# EAGLE design node (EAGLE 6.5.0)
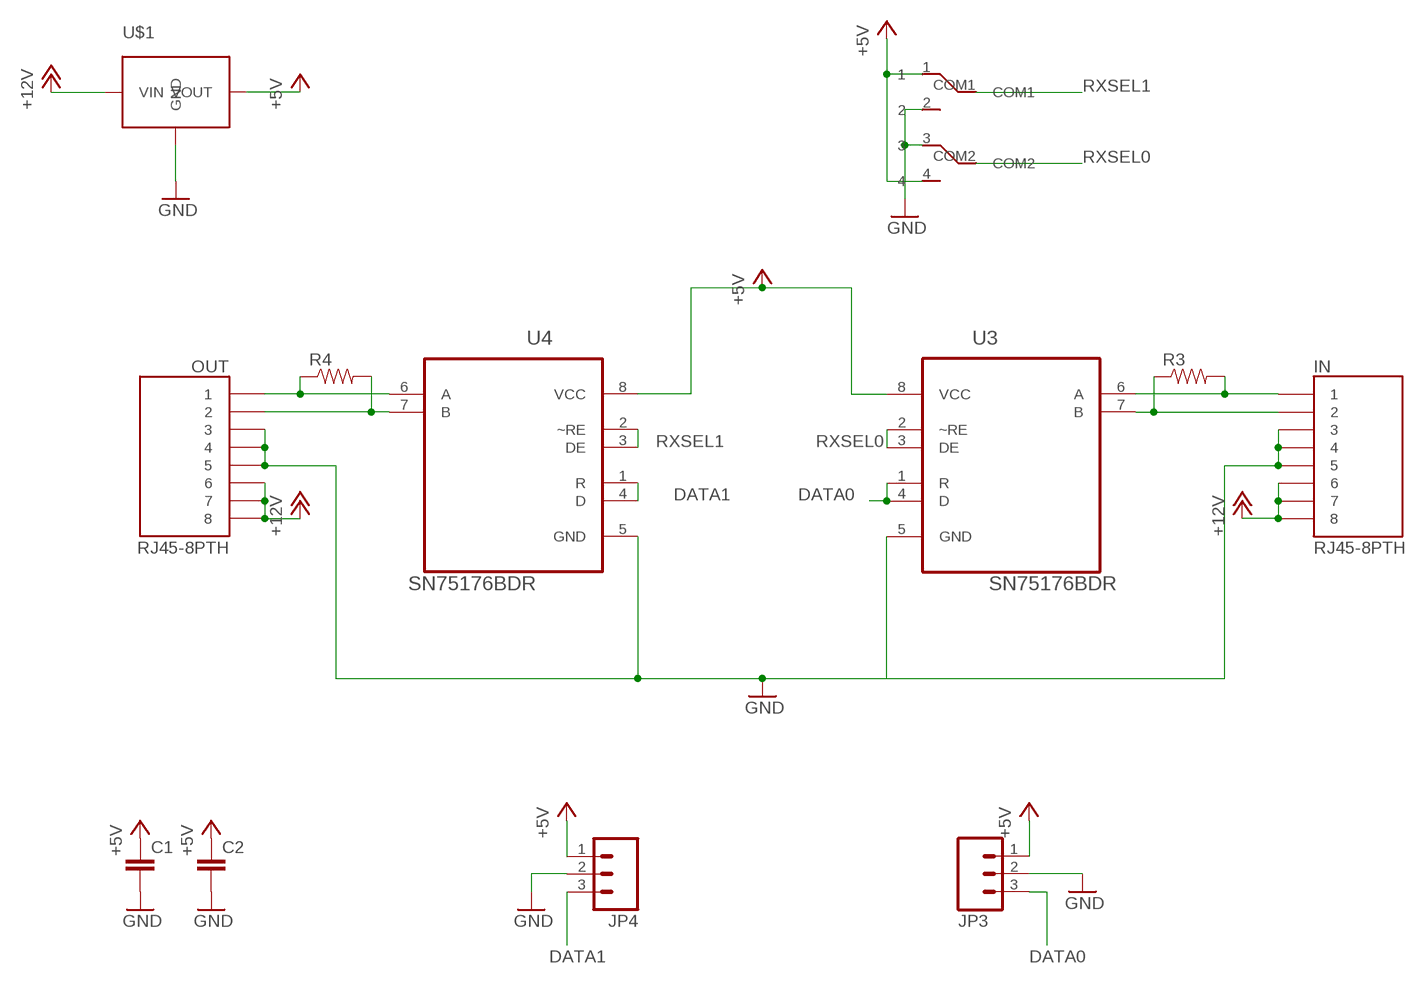
[diagram p0: schematic, sheet 1]

## Parts
C1  CAPPTH1  [CAP-PTH-5MM]
C2  CAPPTH1  [CAP-PTH-5MM]
IN  RJ45-8PTH  [RJ45-8]
JP3  M03JST-PTH  [JST-3-PTH]
JP4  M03JST-PTH  [JST-3-PTH]
OUT  RJ45-8PTH  [RJ45-8]
R3  RESISTORPTH-1/2W  [AXIAL-0.5]
R4  RESISTORPTH-1/2W  [AXIAL-0.5]
U3  SN75176BDR  [SOIC127P600X175-8N]
U4  SN75176BDR  [SOIC127P600X175-8N]
U$1  TSR1-2450  [TSR-1]
U$2  SWITCH-NKK-DPDT  [SWITCH-NKK-DPDT]

## Nets
+5V: C1.1 C2.1 JP3.1 JP4.1 U3.8(VCC) U4.8(VCC) U$1.3(VOUT) U$2.1 U$2.4
+12V: IN.6 IN.7 IN.8 OUT.6 OUT.7 OUT.8 U$1.1(VIN)
DATA0: JP3.3 U3.1(R) U3.4(D)
DATA1: JP4.3 U4.1(R) U4.4(D)
GND: C1.2 C2.2 IN.3 IN.4 IN.5 JP3.2 JP4.2 OUT.3 OUT.4 OUT.5 U3.5(GND) U4.5(GND) U$1.2(GND) U$2.2 U$2.3
N$1: IN.1 R3.P$2 U3.6(A)
N$2: IN.2 R3.P$1 U3.7(B)
N$3: OUT.1 R4.P$1 U4.6(A)
N$4: OUT.2 R4.P$2 U4.7(B)
RXSEL0: U3.2(~RE) U3.3(DE) U$2.COM2
RXSEL1: U4.2(~RE) U4.3(DE) U$2.COM1

## Library data of the parts
C1 C2 = SparkFun-Capacitors:CAP: Capacitor Standard 0603 ceramic capacitor, and 0.1" leaded capacitor.
IN OUT = SparkFun-Connectors:RJ45-8: RJ45 Jack Simple RJ45, 8-pin connection - connector for common Cat5, Cat5e, and Cat6 Ethernet cables. Footprint not yet proven in production. Connector sku is PRT-00643; Breakout PCB sku is BOB-00716.
JP3 JP4 = SparkFun-Connectors:M03: Header 3 Standard 3-pin 0.1" header. Use with straight break away headers (SKU : PRT-00116), right angle break away headers (PRT-00553), swiss pins (PRT-00743), machine pins (PRT-00117), and female headers (PRT-00115). Molex polarized connector foot print use with SKU : PRT-08232 with associated crimp pins and housings.
R3 R4 = SparkFun-Passives:RESISTOR: Resistor Basic schematic elements and footprints for 0603, 1206, and PTH resistors.
U3 U4 = DS75176BN_smt:SN75176BDR: DIFFERENTIAL BUS TRANSCEIVERS; MPN: SN75176BDR; OC_FARNELL: 9853804; OC_NEWARK: 35K0840; PACKAGE: SOIC-8; SUPPLIER: Texas Instruments
U$1 = SteelCaveRobotics-Power:TSR1-2450: Traco Power TSR 1-2450 5.0v switching regulator
U$2 = switch-nkk-dpdt-micro-right:SWITCH-NKK-DPDT

## Board
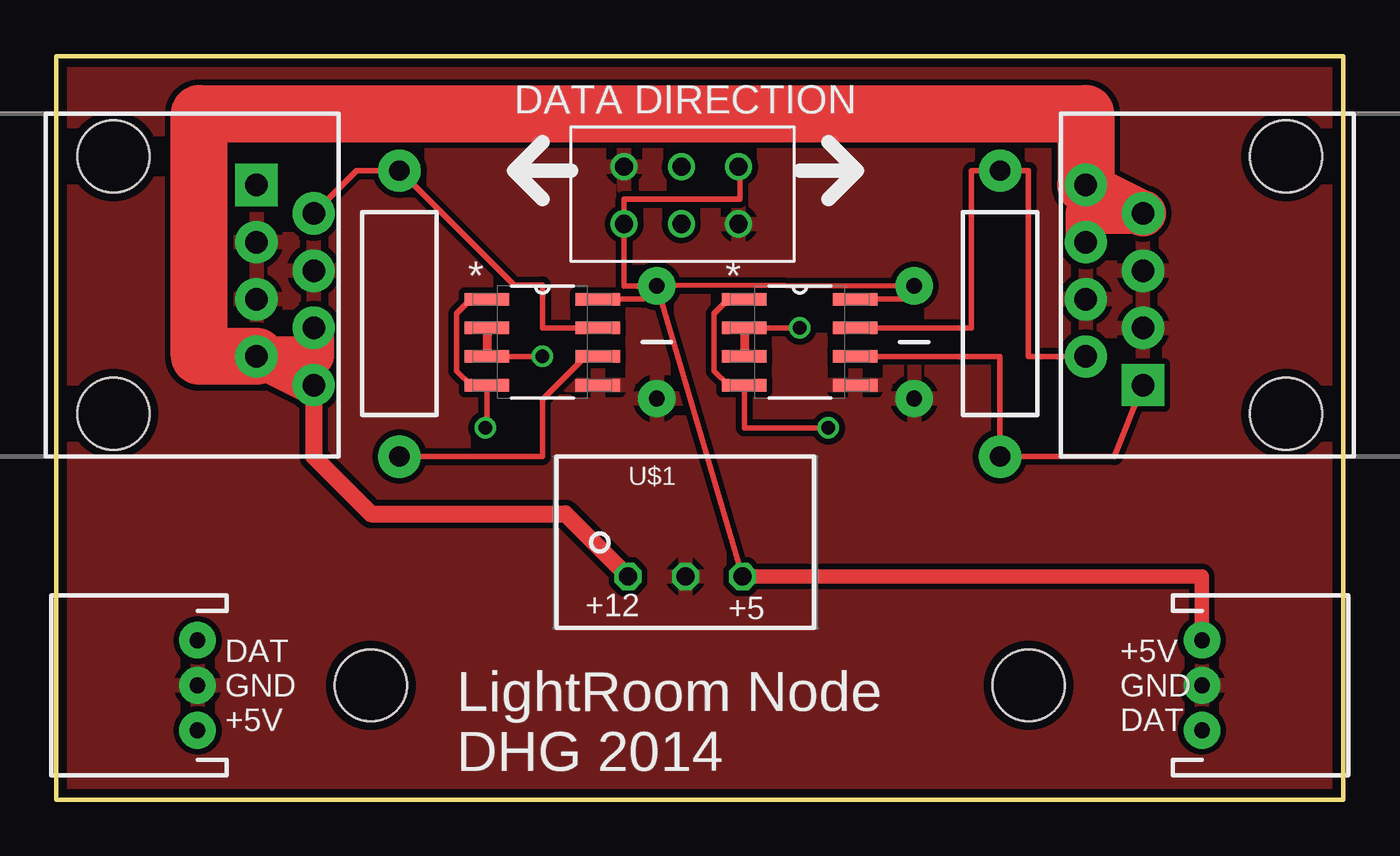
[diagram p1: board, top side]
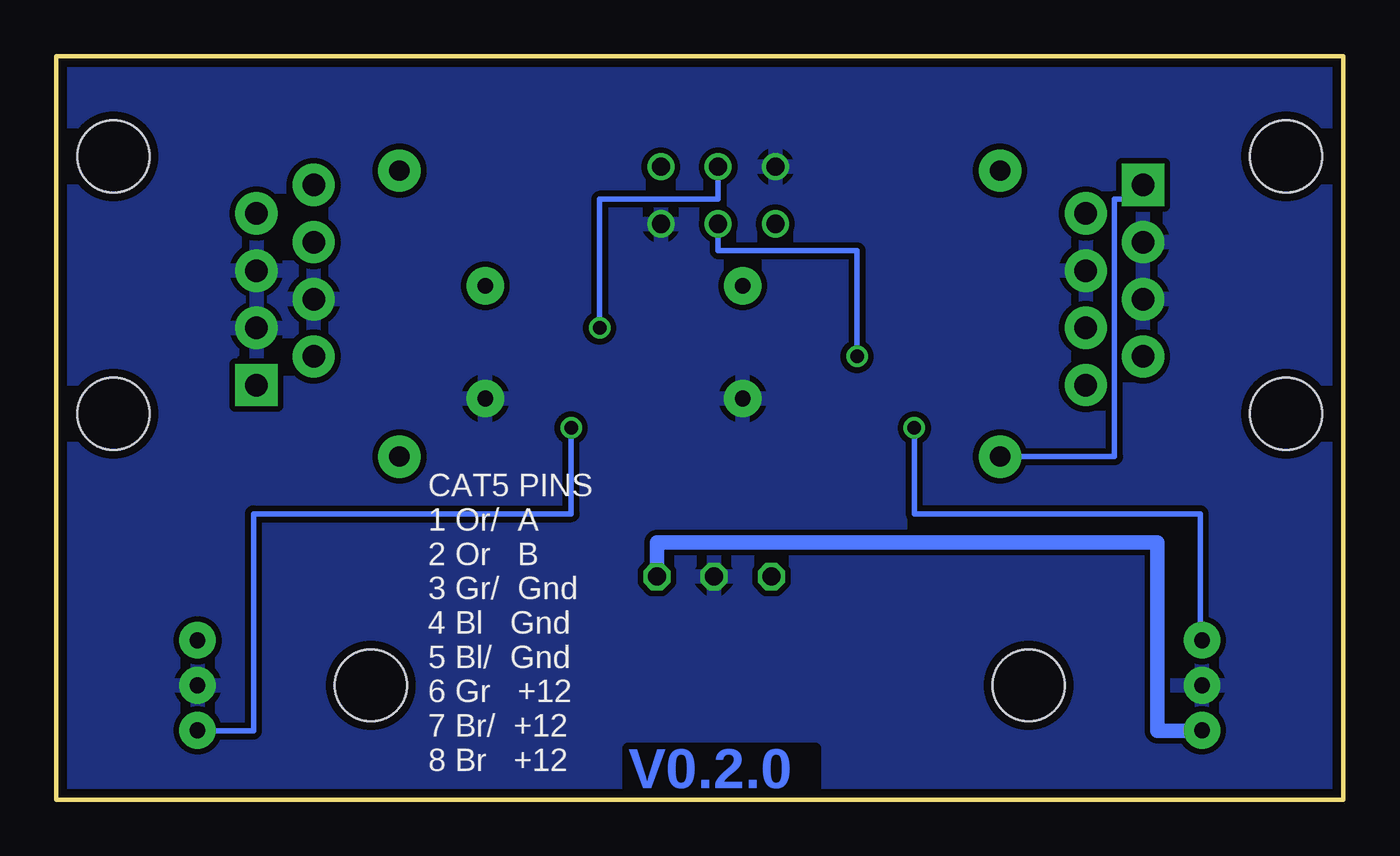
[diagram p2: board, bottom side, seen from below]

Size 57.15 x 33.02 mm. Coordinates in mm from the lower left corner, seen from the top.
Outline: 0,0 57.15,0 57.15,33.02 0,33.02 0,0
Copper layers (1*16): Top 0.0356mm / dielectric 1.5011mm / Bottom 0.0356mm
Design rules "LaenPCBOrder": minimum track width 6mil, minimum drill 13mil, track to track 6mil, track to pad 6mil, pad to pad 6mil, via to via 6mil, smd to smd 6mil, copper to edge 15mil, drill to drill 6mil, minimum pad ring 7mil, minimum via ring 7mil, stop-mask expansion 3mil, vias tented up to drill 0mil, thermal gap 10mil
Holes 3.2 mm at 13.97,5.08 43.18,5.08

### Footprints (pad centres in the part's own frame; a part is rotated, then mirrored left to right if it is on the bottom)
CAP-PTH-5MM = drill 0.7 pad 1.651: 1 -2.5,0; 2 2.5,0
RJ45-8 = drill 1 pad 1.88 square: 1 -4.445,6.35 | drill 1 pad 1.88: 2 -3.175,8.89; 3 -1.905,6.35; 4 -0.635,8.89; 5 0.635,6.35; 6 1.905,8.89; 7 3.175,6.35; 8 4.445,8.89 | hole 3.2: -5.715,0; 5.715,0
JST-3-PTH = drill 0.7 pad 1.626: 1 -2,-5; 2 0,-5; 3 2,-5
AXIAL-0.5 = drill 0.9 pad 1.88: P$1 -6.35,0; P$2 6.35,0
SOIC127P600X175-8N = smd 1.981 x 0.559: 1 -2.464,1.905; 2 -2.464,0.635; 3 -2.464,-0.635; 4 -2.464,-1.905; 5 2.464,-1.905; 6 2.464,-0.635; 7 2.464,0.635; 8 2.464,1.905
TSR-1 = drill 0.8 octagon: 1 -2.54,-1.524; 2 0,-1.524; 3 2.54,-1.524
SWITCH-NKK-DPDT = drill 0.8: 1 2.36,1.7; 2 7.44,1.7; 3 2.36,4.24; 4 7.44,4.24; COM1 4.9,1.7; COM2 4.9,4.24

### Placement (x,y rotation side)
C1  26.67,20.32 270 top
C2  38.1,20.32 270 top
IN  54.61,22.86 90 top
JP3  55.88,5.08 270 top
JP4  1.27,5.08 90 top
OUT  2.54,22.86 270 top
R3  41.91,21.59 270 top
R4  15.24,21.59 90 top
U3  33.02,20.32 0 top
U4  21.59,20.32 0 top
U$1  27.94,11.43 0 top
U$2  22.86,23.88 0 top

### Tracks (layer width: path | path; a pad name or v marks a point on that pad's centre or on a via)
+5V
  Top 0.254: C1.1 26.07,22.23 U4.8 | U$1.3 C1.1 | U3.8 38.1,22.23 C2.1 26.67,22.86 | C1.1 25.22,22.82 U$2.1 25.22,26.67 30.35,26.67 30.35,28.12 U$2.4
  Top 0.406: C1.1 26.67,22.86
  Top 0.635: JP3.1 50.88,9.91 U$1.3
  Bottom 0.635: U$1.3 30.48,11.43 8.26,11.43 8.26,3.05 6.22,3.05 6.22,3.08 JP4.1
+12V
  Top 0.762: OUT.8 11.43,15.24 13.97,12.7 22.61,12.7 U$1.1
  Top 1.778: OUT.8 OUT.7 11.43,19.68 OUT.6 | IN.6 45.72,26.04 IN.7
  Top 2.032: IN.8 IN.7
  Top 2.54: OUT.7 6.35,19.68 6.35,30.48 45.72,30.48 IN.8
DATA0  (via drill 0.6)
  Top 0.254: 29.84,22.23 29.21,21.59 29.21,19.05 29.84,18.41 | v34.29,16.51 30.56,16.51 U3.4
  Top 0.406: U3.1 29.84,22.23 | 29.84,18.41 U3.4
  Bottom 0.254: JP3.3 50.88,3.05 48.39,3.05 48.39,12.7 34.29,12.7 v34.29,16.51
DATA1  (via drill 0.6)
  Top 0.254: 18.41,22.23 17.78,21.59 17.78,19.05 18.41,18.41 | 19.13,16.51 U4.4
  Top 0.406: U4.1 18.41,22.23 | 18.41,18.41 U4.4 | v19.05,16.51 19.13,16.51
  Bottom 0.254: JP4.3 6.35,7.08 6.35,12.7 19.05,12.7 v19.05,16.51
GND
  pour Top (isolate 0.254): 0,33.02 57.15,33.02 57.15,0 0,0
  pour Bottom (isolate 0.254): 0,33.02 57.15,33.02 57.15,0 0,0
  pour Top: 44.45,22.86 48.26,24.13 49.53,24.13 49.53,20.32 48.26,20.32 44.45,21.59
  pour Top: 9.02,25.65 13.34,23.24 8.89,21.59 8.89,25.4
  pour Bottom: 49.53,24.64 44.07,22.35 49.78,19.56 49.78,24.51 49.53,24.13
N$1
  Top 0.254: IN.1 46.99,15.24 R3.P$2 41.91,19.68 U3.6
N$2
  Top 0.254: IN.2 43.18,19.68 43.18,27.94 R3.P$1 40.64,27.94 40.64,20.95 U3.7
N$3
  Top 0.254: R4.P$1 21.59,15.24 21.59,17.78 23.5,19.68
  Top 0.406: 23.5,19.68 U4.6
  Bottom 0.254: R4.P$1 10.16,15.24 10.16,26.67 8.89,26.67
  Bottom 0.406: 8.89,26.67 OUT.1
N$4
  Top 0.254: OUT.2 13.34,27.94 R4.P$2 20.32,22.86 21.59,22.86 21.59,20.95 U4.7
RXSEL0  (via drill 0.6)
  Top 0.254: v33.02,20.95 U3.2
  Top 0.406: U3.2 U3.3
  Bottom 0.254: U$2.COM2 27.76,26.67 33.02,26.67 v33.02,20.95
RXSEL1  (via drill 0.6)
  Top 0.254: v21.59,19.68 U4.3
  Top 0.406: U4.2 U4.3
  Bottom 0.254: U$2.COM1 27.76,24.38 21.59,24.38 v21.59,19.68

### Text on the board
Bottom: V0.2.0
tPlace: DATA DIRECTION | +12 | +5 | DAT / GND / +5V | +5V / GND / DAT | LightRoom Node / DHG 2014
bPlace: CAT5 PINS / 1 Or/ A / 2 Or B / 3 Gr/ Gnd / 4 Bl Gnd / 5 Bl/ Gnd / 6 Gr +12 / 7 Br/ +12 / 8 Br +12